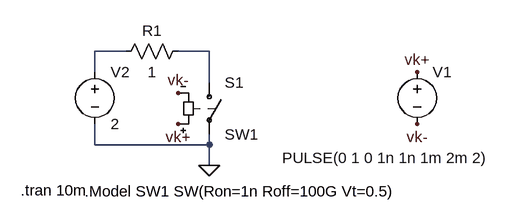
[diagram p0: schematic vkey.asc]
vkey.asc, the LTspice schematic file:
Version 4
SHEET 1 880 680
WIRE 128 128 80 128
WIRE 256 128 208 128
WIRE 80 160 80 128
WIRE 256 176 256 128
WIRE 80 272 80 240
WIRE 256 272 256 256
WIRE 256 272 80 272
WIRE 256 304 256 272
FLAG 576 160 vk+
FLAG 208 240 vk+
FLAG 576 240 vk-
FLAG 208 192 vk-
FLAG 256 304 0
SYMBOL sw 256 160 R0
SYMATTR InstName S1
SYMATTR Value SW1
SYMATTR Value2 0.5
SYMBOL voltage 576 144 R0
WINDOW 3 -208 148 Left 2
WINDOW 123 0 0 Left 0
WINDOW 39 0 0 Left 0
SYMATTR InstName V1
SYMATTR Value PULSE(0 1 0 1n 1n 1m 2m 2)
SYMBOL voltage 80 144 R0
WINDOW 123 0 0 Left 0
WINDOW 39 0 0 Left 0
SYMATTR InstName V2
SYMATTR Value 2
SYMBOL res 224 112 R90
WINDOW 0 0 56 VBottom 2
WINDOW 3 32 56 VTop 2
SYMATTR InstName R1
SYMATTR Value 1
TEXT -34 342 Left 2 !.tran 10m
TEXT 64 344 Left 2 !.Model SW1 SW(Ron=1n Roff=100G Vt=0.5)

The netlist it stands for:
* vkey.asc
S1 N002 0 vk+ vk- SW1 0.5
V1 vk+ vk- PULSE(0 1 0 1n 1n 1m 2m 2)
V2 N001 0 2
R1 N002 N001 1
.tran 10m
.Model SW1 SW(Ron=1n Roff=100G Vt=0.5)
.backanno
.end